# EAGLE design StepperDriver Rev2 (EAGLE 6.1)
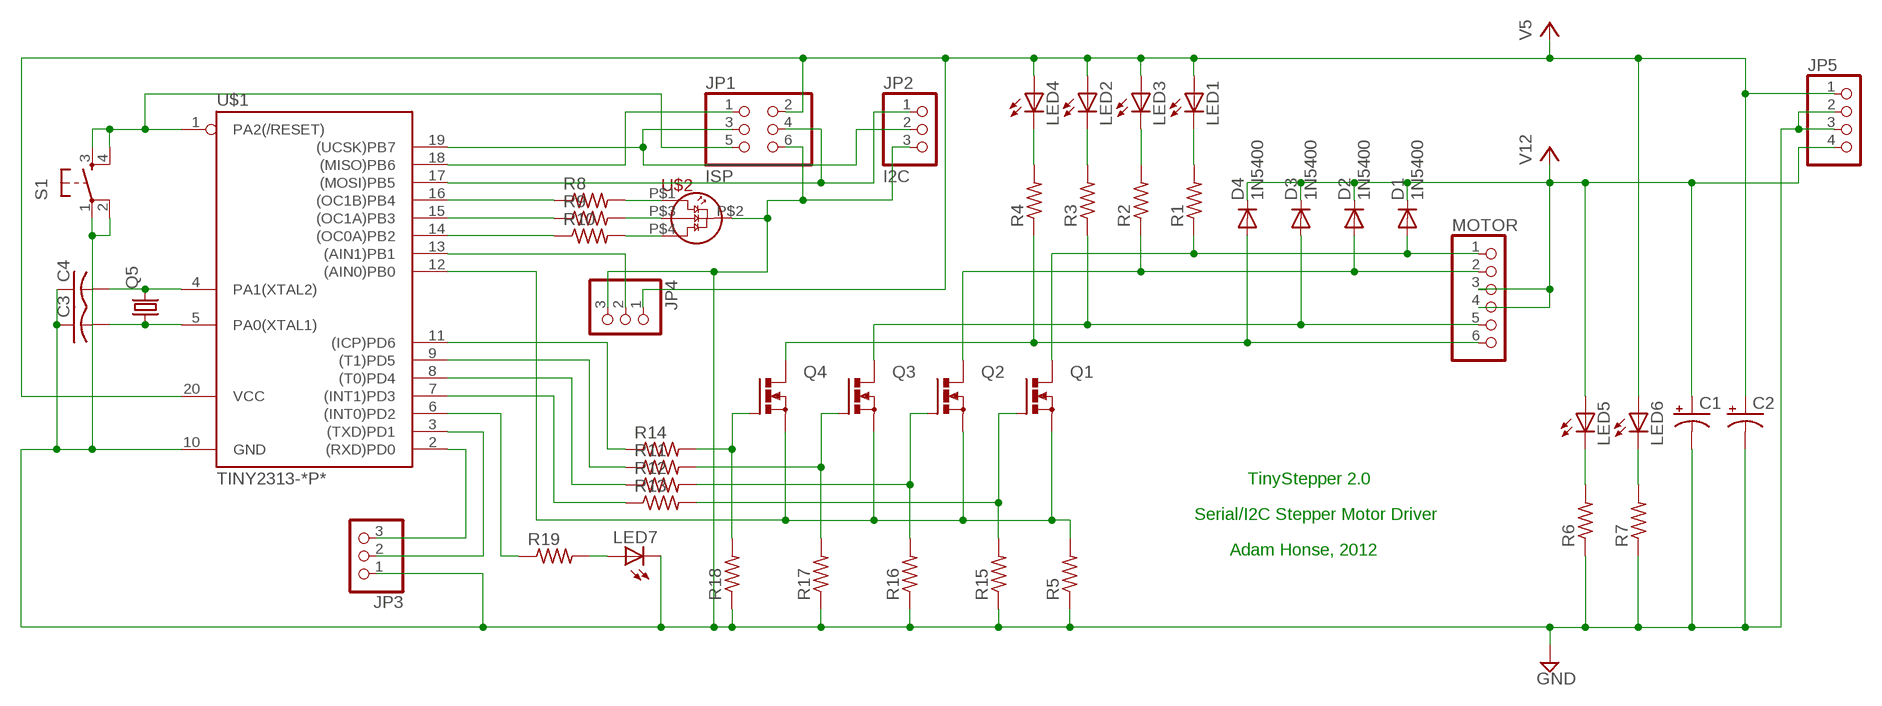
[diagram p0: schematic, sheet 1]

## Parts
C1  CPOL-USE7.5-16  [E7,5-16]
C2  CPOL-USE7.5-16  [E7,5-16]
C3  C-US025-024X044  [C025-024X044]
C4  C-US025-024X044  [C025-024X044]
D1  1N5400  [DO201-15]
D2  1N5400  [DO201-15]
D3  1N5400  [DO201-15]
D4  1N5400  [DO201-15]
JP1  ISP  PINHD-2X3  [2X03]
JP2  I2C  PINHD-1X3  [1X03]
JP3  PINHD-1X3  [1X03]
JP4  PINHD-1X3  [1X03]
JP5  PINHD-1X4  [1X04]
LED1  LED5MM  [LED5MM]
LED2  LED5MM  [LED5MM]
LED3  LED5MM  [LED5MM]
LED4  LED5MM  [LED5MM]
LED5  LED5MM  [LED5MM]
LED6  LED5MM  [LED5MM]
LED7  LED5MM  [LED5MM]
MOTOR  PINHD-1X6  [1X06]
Q1  PMOSFET_NTO220BV  [TO220BV]
Q2  PMOSFET_NTO220BV  [TO220BV]
Q3  PMOSFET_NTO220BV  [TO220BV]
Q4  PMOSFET_NTO220BV  [TO220BV]
Q5  CRYSTALHC49U70  [HC49U70]
R1  R-US_0204/7  [0204/7]
R2  R-US_0204/7  [0204/7]
R3  R-US_0204/7  [0204/7]
R4  R-US_0204/7  [0204/7]
R5  R-US_0617/22  [0617/22]
R6  R-US_0204/7  [0204/7]
R7  R-US_0204/7  [0204/7]
R8  R-US_0204/7  [0204/7]
R9  R-US_0204/7  [0204/7]
R10  R-US_0204/7  [0204/7]
R11  R-US_0204/7  [0204/7]
R12  R-US_0204/7  [0204/7]
R13  R-US_0204/7  [0204/7]
R14  R-US_0204/7  [0204/7]
R15  R-US_0204/7  [0204/7]
R16  R-US_0204/7  [0204/7]
R17  R-US_0204/7  [0204/7]
R18  R-US_0204/7  [0204/7]
R19  R-US_0204/7  [0204/7]
S1  TAC_SWITCHPTH  [TACTILE-PTH]
U$1  TINY2313-*P*  [DIL20]
U$2  5MMRGBLED  [LED5MMRGB]

## Nets
GND: C1.- C2.- C3.1 C4.1 JP1.6 JP2.3 JP3.1 JP4.3 JP5.2 JP5.3 LED7.K(C) R5.1 R6.1 R7.1 R15.1 R16.1 R17.1 R18.1 S1.1 S1.2 U$1.10(GND) U$2.P$2(CATHODE)
N$1: LED4.K(C) R4.2
N$2: D2.A MOTOR.2 Q2.D R2.1
N$3: D1.A MOTOR.1 Q1.D R1.1
N$4: D3.A MOTOR.5 Q3.D R3.1
N$5: D4.A MOTOR.6 Q4.D R4.1
N$6: LED2.K(C) R3.2
N$7: LED3.K(C) R2.2
N$8: LED1.K(C) R1.2
N$9: JP3.3 U$1.2((RXD)PD0)
N$10: JP3.2 U$1.3((TXD)PD1)
N$11: Q1.S Q2.S Q3.S Q4.S R5.2 U$1.12((AIN0)PB0)
N$12: R13.1 U$1.7((INT1)PD3)
N$13: R12.1 U$1.8((T0)PD4)
N$14: R11.1 U$1.9((T1)PD5)
N$15: Q1.G R13.2 R15.2
N$16: JP1.1 U$1.18((MISO)PB6)
N$17: JP1.5 S1.3 S1.4 U$1.1(PA2(/RESET))
N$18: R10.2 U$2.P$4(BLUE)
N$19: JP1.3 JP2.2 U$1.19((UCSK)PB7)
N$20: LED5.K(C) R6.2
N$21: JP1.4 JP2.1 U$1.17((MOSI)PB5)
N$22: LED6.K(C) R7.2
N$23: R9.2 U$2.P$3(GREEN)
N$24: R8.2 U$2.P$1(RED)
N$25: R10.1 U$1.14((OC0A)PB2)
N$26: R9.1 U$1.15((OC1A)PB3)
N$27: R8.1 U$1.16((OC1B)PB4)
N$28: Q2.G R12.2 R16.2
N$29: Q3.G R11.2 R17.2
N$30: Q4.G R14.2 R18.2
N$31: R14.1 U$1.11((ICP)PD6)
N$32: C3.2 Q5.1 U$1.5(PA0(XTAL1))
N$33: LED7.A R19.2
N$34: R19.1 U$1.6((INT0)PD2)
N$36: C4.2 Q5.2 U$1.4(PA1(XTAL2))
N$37: JP4.2 U$1.13((AIN1)PB1)
V5: C2.+ JP1.2 JP4.1 JP5.1 LED1.A LED2.A LED3.A LED4.A LED6.A U$1.20(VCC)
V12: C1.+ D1.C D2.C D3.C D4.C JP5.4 LED5.A MOTOR.3 MOTOR.4

## Notes on the sheet
- TinyStepper 2.0
- Serial/I2C Stepper Motor Driver
- Adam Honse, 2012

## Library data of the parts
C1 C2 = resistor:CPOL-US: POLARIZED CAPACITOR, American symbol
C3 C4 = resistor:C-US: CAPACITOR, American symbol
D1-D4 = diode:1N5400: DIODE standard rectifier, 3 A, 50 V (Motorola)
JP1 = pinhead:PINHD-2X3: PIN HEADER
JP2-JP4 = pinhead:PINHD-1X3: PIN HEADER
JP5 = pinhead:PINHD-1X4: PIN HEADER
LED1-LED7 = led:LED: LED OSRAM: - CHIPLED LG R971, LG N971, LY N971, LG Q971, LY Q971, LO R971, LY R971 LH N974, LH R974 LS Q976, LO Q976, LY Q976 LO Q996 - Hyper CHIPLED LW Q18S LB Q993, LB Q99A, LB R99A - SideLED LS A670, LO A670, LY A670, LG A670, LP A670 LB A673, LV A673, LT A673, LW A673 LH A674 LY A675 LS A676, LA A676, LO A676, LY A676, LW A676 LS A679, LY A679, LG A679 - Hyper Micro SIDELED® LS Y876, LA Y876, LO Y876, LY Y876 LT Y87S - SmartLED LW L88C, LW L88S LB L89C, LB L89S, LG L890 LS L89K, LO L89K, LY L89K LS L896, LA L896, LO L896, LY L896 - TOPLED LS T670, LO T670, LY T670, LG T670, LP T670 LSG T670, LSP T670, LSY T670, LOP T670, LYG T670 LG T671, LOG T671, LSG T671 LB T673, LV T673, LT T673, LW T673 LH T674 LS T676, LA T676, LO T676, LY T676, LB T676, LH T676, LSB T676, LW T676 LB T67C, LV T67C, LT T67C, LS T67K, LO T67K, LY T67K, LW E67C LS E67B, LA E67B, LO E67B, LY E67B, LB E67C, LV E67C, LT E67C LW T67C LS T679, LY T679, LG T679 LS T770, LO T770, LY T770, LG T770, LP T770 LB T773, LV T773, LT T773, LW T773 LH T774 LS E675, LA E675, LY E675, LS T675 LS T776, LA T776, LO T776, LY T776, LB T776 LHGB T686 LT T68C, LB T68C - Hyper Mini TOPLED® LB M676 - Mini TOPLED Santana® LG M470 LS M47K, LO M47K, LY M47K Source: http://www.osram.convergy.de LUXEON: - LUMILED® LXK2-PW12-R00, LXK2-PW12-S00, LXK2-PW14-U00, LXK2-PW14-V00 LXK2-PM12-R00, LXK2-PM12-S00, LXK2-PM14-U00 LXK2-PE12-Q00, LXK2-PE12-R00, LXK2-PE12-S00, LXK2-PE14-T00, LXK2-PE14-U00 LXK2-PB12-K00, LXK2-PB12-L00, LXK2-PB12-M00, LXK2-PB14-N00, LXK2-PB14-P00, LXK2-PB14-Q00 LXK2-PR12-L00, LXK2-PR12-M00, LXK2-PR14-Q00, LXK2-PR14-R00 LXK2-PD12-Q00, LXK2-PD12-R00, LXK2-PD12-S00 LXK2-PH12-R00, LXK2-PH12-S00 LXK2-PL12-P00, LXK2-PL12-Q00, LXK2-PL12-R00 Source: www.luxeon.com KINGBRIGHT: KA-3528ASYC Source: www.kingbright.com
MOTOR = pinhead:PINHD-1X6: PIN HEADER
Q1-Q4 = transistor-power:PMOSFET_N: Power MOSFET N-Channel
Q5 = crystal:CRYSTAL: CRYSTAL; OC_FARNELL: unknown; OC_NEWARK: unknown
R1-R19 = resistor:R-US_: RESISTOR, American symbol
S1 = SparkFun-Electromechanical:TAC_SWITCH: Momentary Switch Button commonly used for reset or general input. Spark Fun Electronics SKU : COM-00097
U$1 = avr-7:TINY2313*: Atmel Tiny2313 2K Flash, 128 bytes EEPROM, 128 bytes RAM
U$2 = led_rgb:5MMRGBLED

## Board
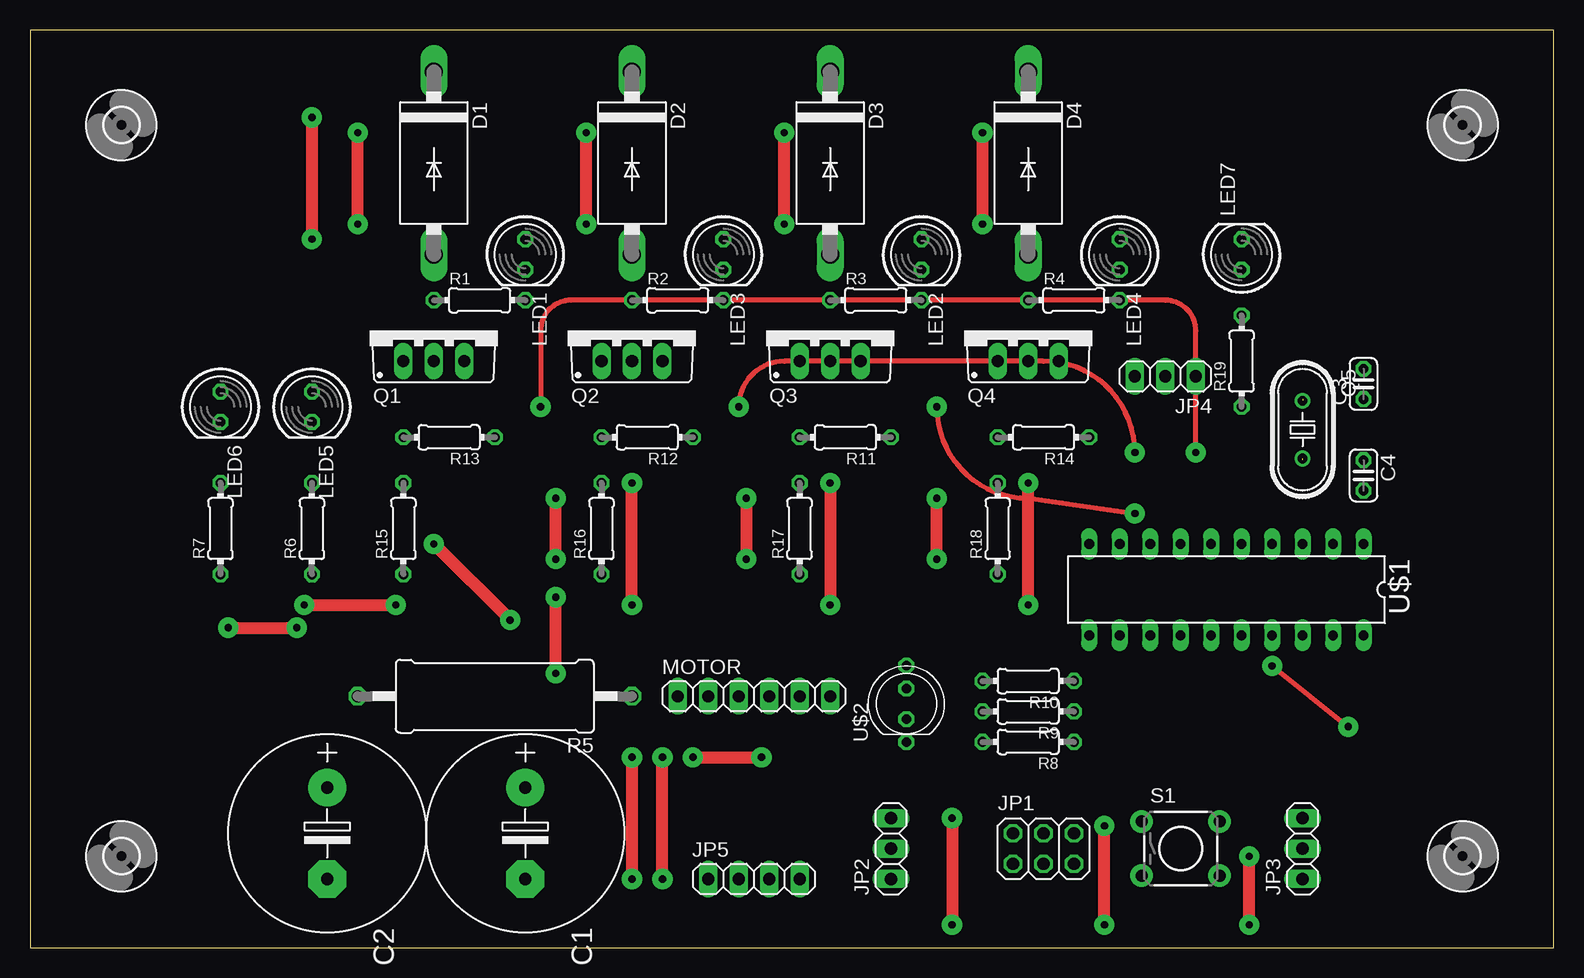
[diagram p1: board, top side]
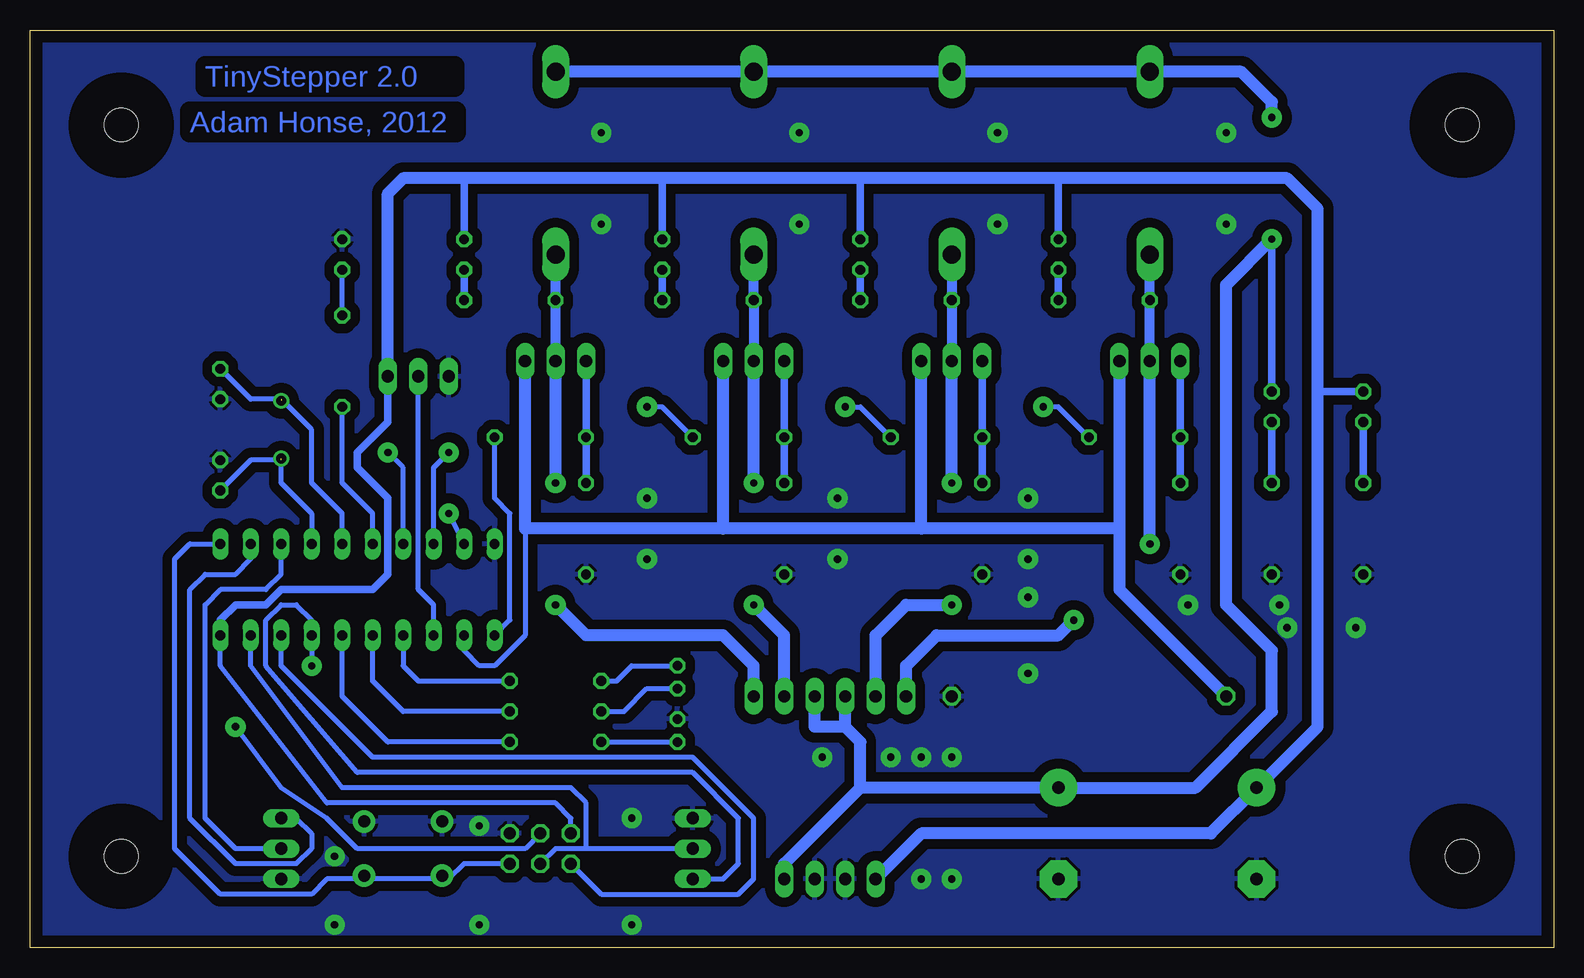
[diagram p2: board, bottom side, seen from below]

Size 126.98 x 76.5 mm. Coordinates in mm from the lower left corner, seen from the top.
Outline: 0,0 126.98,0 126.98,76.5 0,76.5 0,0
Copper layers (1*16): Top 0.035mm / dielectric 1.5mm / Bottom 0.035mm
Design rules: minimum track width 10mil, minimum drill 24mil, track to track 8mil, track to pad 8mil, pad to pad 8mil, via to via 8mil, smd to smd 8mil, copper to edge 40mil, drill to drill 8mil, minimum pad ring 10mil, minimum via ring 8mil, stop-mask expansion 4mil, vias tented up to drill 0mil, thermal gap 10mil

### Footprints (pad centres in the part's own frame; a part is rotated, then mirrored left to right if it is on the bottom)
E7,5-16 = drill 1.016 pad 3.15: + -3.81,0 | drill 1.016 pad 3.15 octagon: - 3.81,0
C025-024X044 = drill 0.813 octagon: 1 -1.27,0; 2 1.27,0
DO201-15 = drill 1.499 long: A 7.62,0; C -7.62,0
2X03 = drill 1.016 octagon: 1 -2.54,-1.27; 2 -2.54,1.27; 3 0,-1.27; 4 0,1.27; 5 2.54,-1.27; 6 2.54,1.27
1X03 = drill 1.016 long: 1 -2.54,0; 2 0,0; 3 2.54,0
1X04 = drill 1.016 long: 1 -3.81,0; 2 -1.27,0; 3 1.27,0; 4 3.81,0
LED5MM = drill 0.813 octagon: A -1.27,0; K 1.27,0
1X06 = drill 1.016 long: 1 -6.35,0; 2 -3.81,0; 3 -1.27,0; 4 1.27,0; 5 3.81,0; 6 6.35,0
TO220BV = drill 1.016 long: D 0,-2.54; G -2.54,-2.54; S 2.54,-2.54
HC49U70 = drill 0.813: 1 -2.413,0; 2 2.413,0
0204/7 = drill 0.813 octagon: 1 -3.81,0; 2 3.81,0
0617/22 = drill 1.016 octagon: 1 -11.43,0; 2 11.43,0
TACTILE-PTH = drill 1.016 pad 1.88: 1 -3.251,2.261; 2 3.251,2.261; 3 -3.251,-2.261; 4 3.251,-2.261
DIL20 = drill 0.813 long: 1 -11.43,-3.81; 2 -8.89,-3.81; 3 -6.35,-3.81; 4 -3.81,-3.81; 5 -1.27,-3.81; 6 1.27,-3.81; 7 3.81,-3.81; 8 6.35,-3.81; 9 8.89,-3.81; 10 11.43,-3.81; 11 11.43,3.81; 12 8.89,3.81; 13 6.35,3.81; 14 3.81,3.81; 15 1.27,3.81; 16 -1.27,3.81; 17 -3.81,3.81; 18 -6.35,3.81; 19 -8.89,3.81; 20 -11.43,3.81
LED5MMRGB = drill 0.8 pad 0.813 octagon: P$1 -3.175,0; P$2 -1.27,0; P$3 1.27,0; P$4 3.175,0
2,8 = hole 2.8: 0,0

### Placement (x,y rotation side)
C1  41.27,9.53 270 top
C2  24.77,9.53 270 top
C3  111.12,46.99 90 top
C4  111.12,39.37 270 top
D1  33.66,65.41 270 top
D2  50.16,65.41 270 top
D3  66.67,65.41 270 top
D4  83.19,65.41 270 top
JP1  84.45,8.26 0 top
JP2  71.75,8.26 90 top
JP3  106.05,8.26 90 top
JP4  94.61,47.62 180 top
JP5  60.33,5.71 0 top
LED1  41.27,57.78 270 top
LED2  74.3,57.78 270 top
LED3  57.78,57.78 270 top
LED4  90.81,57.78 270 top
LED5  23.5,45.09 270 top
LED6  15.88,45.09 270 top
LED7  100.97,57.78 90 top
MOTOR  60.33,20.95 0 top
Q1  33.66,51.44 0 top
Q2  50.16,51.44 0 top
Q3  66.67,51.44 0 top
Q4  83.19,51.44 0 top
Q5  106.05,43.18 270 top
R1  37.47,53.98 0 top
R2  53.98,53.98 0 top
R3  70.48,53.98 0 top
R4  87,53.98 0 top
R5  38.73,20.95 180 top
R6  23.5,34.92 90 top
R7  15.88,34.92 90 top
R8  83.19,17.14 180 top
R9  83.19,19.68 180 top
R10  83.19,22.23 180 top
R11  67.94,42.55 180 top
R12  51.44,42.55 180 top
R13  34.92,42.55 180 top
R14  84.45,42.55 180 top
R15  31.11,34.92 90 top
R16  47.62,34.92 90 top
R17  64.14,34.92 90 top
R18  80.64,34.92 90 top
R19  100.97,48.9 90 top
S1  95.89,8.26 0 top
U$1  99.69,29.84 180 top
U$2  73.03,20.32 90 top
U$3  [2,8]  7.62,68.58 0 top
U$4  [2,8]  7.62,7.62 0 top
U$5  [2,8]  119.38,7.62 0 top
U$6  [2,8]  119.38,68.58 0 top

### Tracks (layer width: path | path; a pad name or v marks a point on that pad's centre or on a via)
GND  (via drill 0.6 pad 1.68)
  Top 1.016: v27.3,60.33 v27.3,67.94 | v46.35,60.33 v46.35,67.94 | v62.87,60.33 v62.87,67.94 | v79.38,60.33 v79.38,67.94 | v50.16,15.88 v50.16,5.71 | v52.7,5.71 v52.7,15.88 | v76.83,10.79 v76.83,1.91 | v89.53,1.91 v89.53,10.16 | v101.6,1.91 v101.6,7.62 | v43.81,32.38 v43.81,37.47 | v59.69,37.47 v59.69,32.38 | v75.56,32.38 v75.56,37.47 | v43.81,22.86 v43.81,29.21 | v16.51,26.67 v22.23,26.67 | v22.86,28.57 v30.48,28.57 | v55.24,15.88 v60.96,15.88
  pour Bottom (isolate 0.813): 0,76.83 127,76.2 127,0 0,0
N$1
  Bottom 0.61: R4.2 LED4.K
N$2  (via drill 0.6 pad 1.68)
  Top 1.016: v50.16,28.57 v50.16,38.73
  Bottom 0.813: D2.A R2.1 Q2.D
  Bottom 1.016: MOTOR.2 56.52,26.04 53.98,28.57 v50.16,28.57 | v50.16,38.73 Q2.D
N$3  (via drill 0.6 pad 1.68)
  Top 1.016: v40.01,27.3 v33.66,33.66
  Bottom 0.813: Q1.D R1.1 D1.A
  Bottom 1.016: MOTOR.1 53.98,23.5 51.44,26.04 41.27,26.04 v40.01,27.3 | v33.66,33.66 Q1.D
N$4  (via drill 0.6 pad 1.68)
  Top 1.016: v66.67,38.73 v66.67,28.57
  Bottom 0.813: D3.A R3.1 Q3.D
  Bottom 1.016: MOTOR.5 64.14,26.04 v66.67,28.57 | v66.67,38.73 Q3.D
N$5  (via drill 0.6 pad 1.68)
  Top 1.016: v83.19,28.57 v83.19,38.73
  Bottom 0.813: Q4.D R4.1 D4.A
  Bottom 1.016: MOTOR.6 66.67,23.5 69.22,26.04 80.64,26.04 v83.19,28.57 | v83.19,38.73 Q4.D
N$6
  Bottom 0.61: R3.2 LED2.K
N$7
  Bottom 0.61: LED3.K R2.2
N$8
  Bottom 0.61: R1.2 LED1.K
N$9
  Bottom 0.406: U$1.2 108.58,32.38 109.86,31.11 112.39,31.11 113.67,29.84 113.67,10.79 109.86,6.99 104.78,6.99 103.5,8.26 103.5,9.53 104.78,10.79 JP3.3
N$10
  Bottom 0.406: JP3.2 109.86,8.26 112.39,10.79 112.39,28.57 111.12,29.84 107.31,29.84 106.05,31.11 U$1.3
N$11
  Bottom 0.406: 85.72,34.92 85.72,26.04 88.27,23.5 89.53,23.5 90.81,24.77 U$1.12
  Bottom 1.016: Q1.S 36.2,34.92 | 36.2,34.92 52.7,34.92 | 52.7,34.92 Q2.S | 52.7,34.92 69.22,34.92 | 69.22,34.92 Q3.S | 69.22,34.92 85.72,34.92 Q4.S | 36.2,34.92 36.2,29.84 R5.2
N$12  (via drill 0.6 pad 1.68)
  Top 0.406: v97.16,41.27 97.16,51.44 arc90 94.61,53.98 45.09,53.98 arc90 42.55,51.44 v42.55,45.09
  Bottom 0.406: U$1.7 95.89,40.01 v97.16,41.27 | R13.1 41.27,45.09 v42.55,45.09
N$13  (via drill 0.6 pad 1.68)
  Top 0.406: v92.08,41.27 arc90 84.45,48.9 62.87,48.9 arc90 v59.05,45.09
  Bottom 0.406: R12.1 57.78,45.09 v59.05,45.09 | U$1.8 93.34,40.01 v92.08,41.27
N$14  (via drill 0.6 pad 1.68)
  Top 0.406: v75.56,45.09 arc90 83.19,37.47 v92.08,36.2
  Bottom 0.406: R11.1 74.3,45.09 v75.56,45.09 | U$1.9 v92.08,36.2
N$15
  Bottom 0.61: R15.2 R13.2 Q1.G
N$16
  Bottom 0.406: JP1.1 79.38,4.45 67.94,4.45 66.67,5.71 66.67,10.79 71.75,15.88 98.42,15.88 106.05,23.5 U$1.18
N$17
  Bottom 0.406: JP1.5 90.81,6.99 92.08,5.71 92.71,5.71 99.06,5.71 102.23,5.71 103.5,4.45 111.12,4.45 114.94,8.26 114.94,32.38 113.67,33.66 U$1.1
  Bottom 1.016: S1.3 92.71,5.99 92.71,5.71 | S1.4 99.06,5.99 99.06,5.71
N$18
  Bottom 0.406: R10.2 78.11,22.23 76.83,23.5 U$2.P$4
N$19
  Bottom 0.406: JP2.2 80.64,8.26 | 80.64,8.26 83.19,8.26 JP1.3 | 80.64,8.26 80.64,12.06 81.92,13.34 100.97,13.34 108.58,23.5 U$1.19
N$20
  Bottom 0.61: R6.2 LED5.K
N$21  (via drill 0.6 pad 1.68)
  Top 0.406: v103.5,23.5 v109.86,18.41
  Bottom 0.406: JP2.1 69.22,5.71 67.94,6.99 67.94,10.79 71.75,14.61 99.69,14.61 107.31,23.5 107.31,27.3 106.05,28.57 104.78,28.57 103.5,27.3 U$1.17 v103.5,23.5 | JP1.4 85.72,8.26 99.69,8.26 102.23,10.79 106.05,13.34 v109.86,18.41
N$22
  Bottom 0.61: R7.2 LED6.K
N$23
  Bottom 0.406: R9.2 77.47,19.68 75.56,21.59 U$2.P$3
N$24
  Bottom 0.406: R8.2 U$2.P$1
N$25
  Bottom 0.406: U$1.14 95.89,23.5 94.61,22.23 R10.1
N$26
  Bottom 0.406: R9.1 95.89,19.68 98.42,22.23 U$1.15
N$27
  Bottom 0.406: R8.1 97.16,17.14 100.97,20.95 U$1.16
N$28
  Bottom 0.61: R16.2 R12.2 Q2.G
N$29
  Bottom 0.61: R17.2 R11.2 Q3.G
N$30
  Bottom 0.61: R18.2 R14.2 Q4.G
N$31
  Bottom 0.406: U$1.11 87,27.3 87,36.2 88.27,37.47 R14.1
N$32  (1 unrouted)
  Bottom 0.406: U$1.5 100.97,36.2 103.5,38.73 103.5,43.18 106.05,45.72 108.58,45.72 C3.2
N$33
  Bottom 0.406: R19.2 LED7.A
N$34
  Bottom 0.406: U$1.6 98.42,36.2 100.97,38.73 R19.1
N$36  (1 unrouted)
  Bottom 0.406: U$1.4 103.5,36.2 106.05,38.73 106.05,40.64 108.58,40.64 C4.2
N$37
  Bottom 0.406: U$1.13 93.34,28.57 94.61,29.84 JP4.2
V5
  Bottom 0.406: JP1.2 81.92,10.79 83.19,12.06 102.23,12.06 111.12,23.5 U$1.20
  Bottom 0.61: LED6.A 19.68,46.35 | LED1.A 41.27,64.14 | LED3.A 57.78,64.14 | LED2.A 74.3,64.14 | LED4.A 90.81,64.14 | JP4.1 97.16,43.81 99.69,41.27 99.69,40.01 97.16,37.47 97.16,31.11 98.42,29.84 106.05,29.84 107.31,28.57 109.86,28.57 111.12,27.3 U$1.20
  Bottom 1.016: JP5.1 52.7,9.53 28.57,9.53 C2.+ 19.68,18.41 19.68,46.35 19.68,61.59 22.23,64.14 41.27,64.14 57.78,64.14 74.3,64.14 90.81,64.14 95.89,64.14 97.16,62.87 JP4.1
V12  (via drill 0.6 pad 1.68)
  Top 1.016: v23.5,69.22 v23.5,59.05
  Bottom 0.61: LED5.A v23.5,59.05
  Bottom 1.016: D4.C D3.C D2.C D1.C 26.04,73.03 23.5,70.48 v23.5,69.22 | v23.5,59.05 27.3,55.24 27.3,28.57 23.5,24.77 23.5,19.68 29.84,13.34 C1.+ 57.78,13.34 | JP5.4 64.14,6.99 57.78,13.34 | 57.78,13.34 57.78,17.14 59.05,18.41 | 59.05,18.41 MOTOR.3 | 59.05,18.41 61.59,18.41 MOTOR.4

### Text on the board
Bottom: TinyStepper 2.0 | Adam Honse, 2012